# EAGLE design breakout (EAGLE 6.5.0)
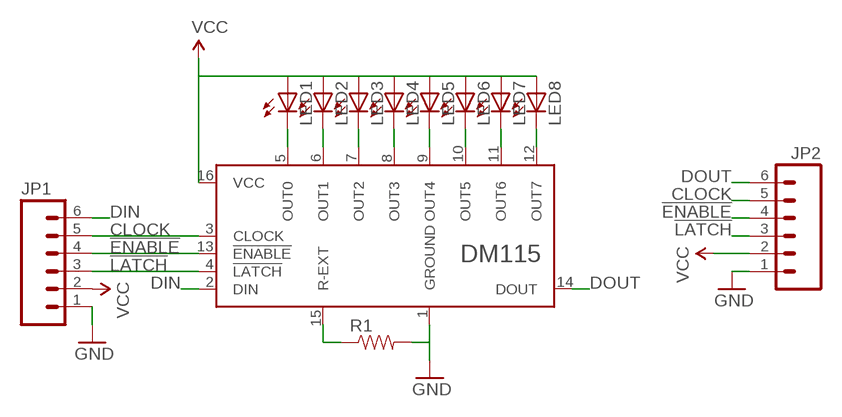
[diagram p0: schematic, sheet 1]

## Parts
JP1  M06SIP  [1X06]
JP2  M06SIP  [1X06]
LED1  LEDOVAL  [LED-OVAL]
LED2  LEDOVAL  [LED-OVAL]
LED3  LEDOVAL  [LED-OVAL]
LED4  LEDOVAL  [LED-OVAL]
LED5  LEDOVAL  [LED-OVAL]
LED6  LEDOVAL  [LED-OVAL]
LED7  LEDOVAL  [LED-OVAL]
LED8  LEDOVAL  [LED-OVAL]
R1  RESISTORAXIAL-0.3  [AXIAL-0.3]
U$1  DM115DIP16  [DIL16]

## Nets
!ENABLE: JP1.4 JP2.4 U$1.13(!ENABLE)
!LATCH: JP1.3 JP2.3 U$1.4(!LATCH)
CLOCK: JP1.5 JP2.5 U$1.3(CLOCK)
DIN: JP1.6 U$1.2(DIN)
DOUT: JP2.6 U$1.14(DOUT)
GND: JP1.1 JP2.1 R1.P$2 U$1.1(GROUND)
N$1: R1.P$1 U$1.15(R-EXT)
N$2: LED1.CATHODE(C) U$1.5(OUT0)
N$3: LED2.CATHODE(C) U$1.6(OUT1)
N$4: LED3.CATHODE(C) U$1.7(OUT2)
N$5: LED4.CATHODE(C) U$1.8(OUT3)
N$6: LED5.CATHODE(C) U$1.9(OUT4)
N$7: LED6.CATHODE(C) U$1.10(OUT5)
N$8: LED7.CATHODE(C) U$1.11(OUT6)
N$9: LED8.CATHODE(C) U$1.12(OUT7)
VCC: JP1.2 JP2.2 LED1.ANODE(A) LED2.ANODE(A) LED3.ANODE(A) LED4.ANODE(A) LED5.ANODE(A) LED6.ANODE(A) LED7.ANODE(A) LED8.ANODE(A) U$1.16(VCC)

## Library data of the parts
JP1 JP2 = dm115:M06: Header 6 Standard 6-pin 0.1" header. Use with straight break away headers (SKU : PRT-00116), right angle break away headers (PRT-00553), swiss pins (PRT-00743), machine pins (PRT-00117), and female headers (PRT-00115). Molex polarized connector foot print use with SKU : PRT-08094 with associated crimp pins and housings. NOTES ON THE VARIANTS LOCK and LOCK_LONGPADS... This footprint was designed to help hold the alignment of a through-hole component (i.e. 6-pin header) while soldering it into place. You may notice that each hole has been shifted either up or down by 0.005 of an inch from it's more standard position (which is a perfectly straight line). This slight alteration caused the pins (the squares in the middle) to touch the edges of the holes. Because they are alternating, it causes a "brace" to hold the component in place. 0.005 has proven to be the perfect amount of "off-center" position when using our standard breakaway headers. Although looks a little odd when you look at the bare footprint, once you have a header in there, the alteration is very hard to notice. Also,if you push a header all the way into place, it is covered up entirely on the bottom side. This idea of altering the position of holes to aid alignment will be further integrated into the Sparkfun Library for other footprints. It can help hold any component with 3 or more connection pins.
LED1-LED8 = dm115:LED: LEDs Standard schematic elements and footprints for 5mm, 3mm, 1206, and 0603 sized LEDs. 5mm - Spark Fun Electronics SKU : COM-00529 (and others)
R1 = dm115:RESISTOR: Resistor Basic schematic elements and footprints for 0603, 1206, and PTH resistors.
U$1 = dm115:DM115

## Board
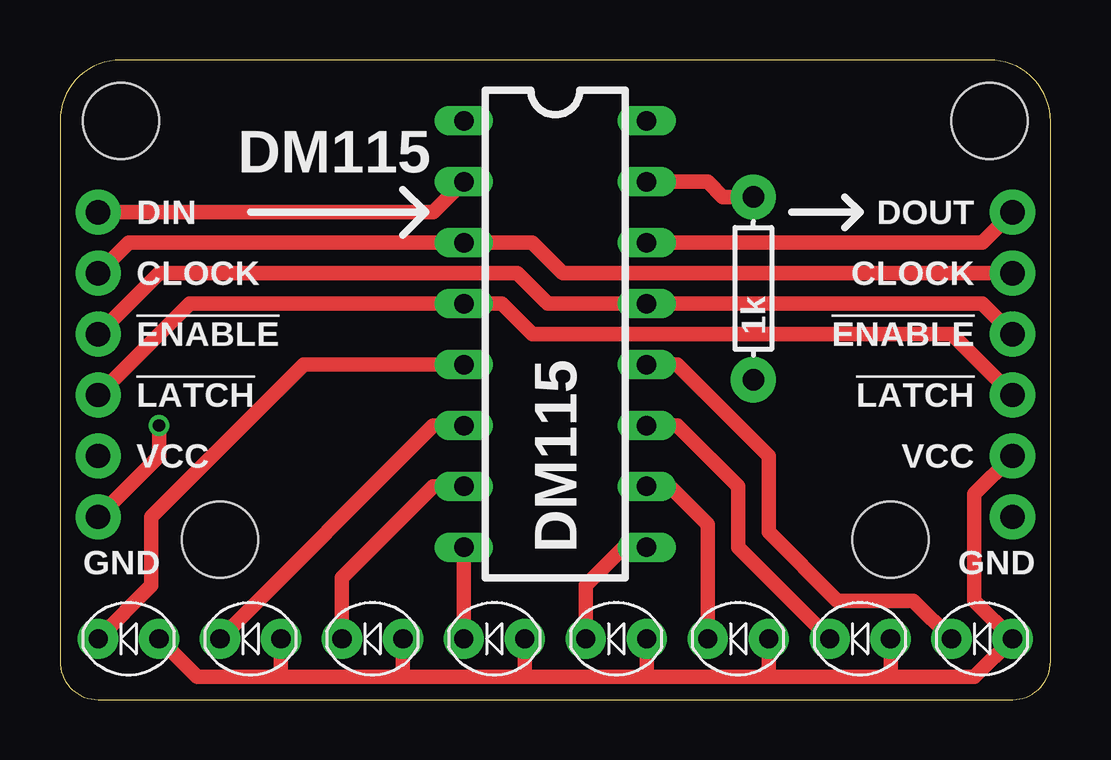
[diagram p1: board, top side]
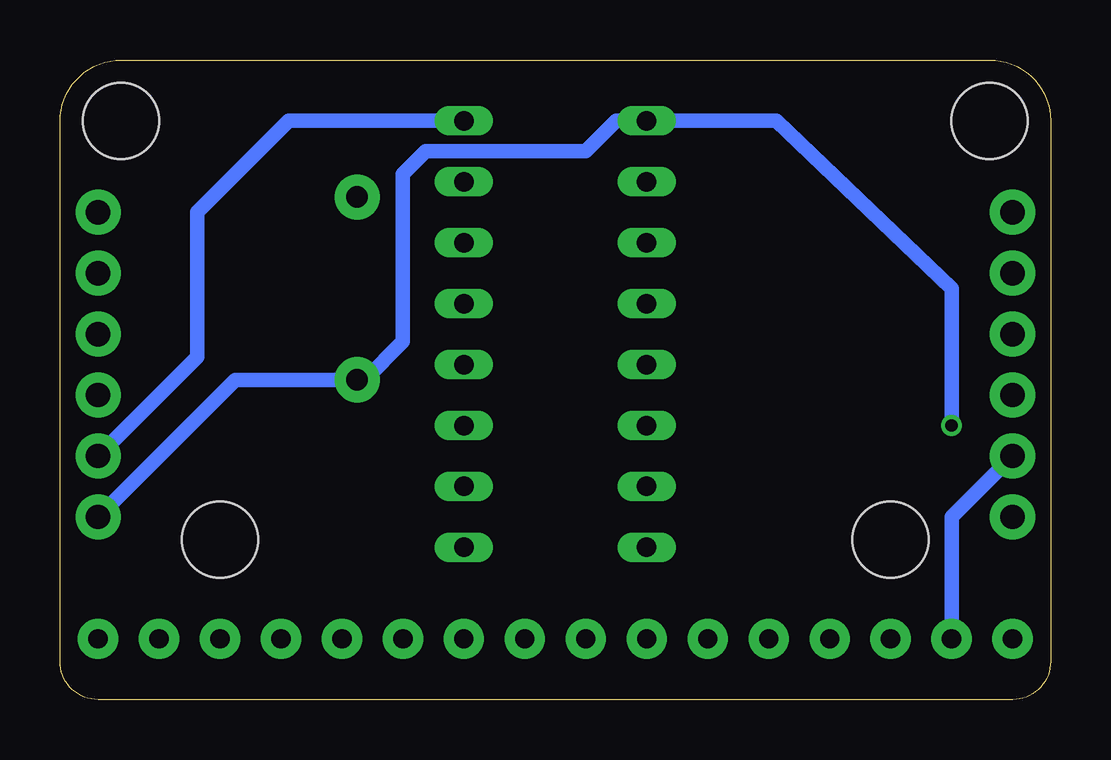
[diagram p2: board, bottom side, seen from below]

Size 41.27 x 26.67 mm. Coordinates in mm from the lower left corner, seen from the top.
Outline: 41.27,1.59 41.27,24.11 arc90 38.72,26.67 2.54,26.67 arc90 0,24.13 0,1.59 arc90 1.59,0 39.69,0 arc90 41.27,1.59
Copper layers (1*16): Top 0.0356mm / dielectric 1.5011mm / Bottom 0.0356mm
Design rules "LaenPCBOrder": minimum track width 6mil, minimum drill 13mil, track to track 6mil, track to pad 6mil, pad to pad 6mil, via to via 6mil, smd to smd 6mil, copper to edge 15mil, drill to drill 6mil, minimum pad ring 7mil, minimum via ring 7mil, stop-mask expansion 3mil, vias tented up to drill 0mil, thermal gap 10mil
Holes 3.17 mm at 2.54,24.13 38.73,24.13 6.67,6.67 34.61,6.67

### Footprints (pad centres in the part's own frame; a part is rotated, then mirrored left to right if it is on the bottom)
1X06 = drill 1.016 pad 1.88: 1 0,0; 2 2.54,0; 3 5.08,0; 4 7.62,0; 5 10.16,0; 6 12.7,0
LED-OVAL = drill 0.8 pad 1.676: ANODE 1.27,0; CATHODE -1.27,0
AXIAL-0.3 = drill 0.9 pad 1.88: P$1 -3.81,0; P$2 3.81,0
DIL16 = drill 0.813 long: 1 -8.89,-3.81; 2 -6.35,-3.81; 3 -3.81,-3.81; 4 -1.27,-3.81; 5 1.27,-3.81; 6 3.81,-3.81; 7 6.35,-3.81; 8 8.89,-3.81; 9 8.89,3.81; 10 6.35,3.81; 11 3.81,3.81; 12 1.27,3.81; 13 -1.27,3.81; 14 -3.81,3.81; 15 -6.35,3.81; 16 -8.89,3.81

### Placement (x,y rotation side)
JP1  1.59,7.62 90 top
JP2  39.69,7.62 90 top
LED1  2.86,2.54 0 top
LED2  7.94,2.54 0 top
LED3  13.02,2.54 0 top
LED4  18.1,2.54 0 top
LED5  23.18,2.54 0 top
LED6  28.26,2.54 0 top
LED7  33.34,2.54 0 top
LED8  38.42,2.54 0 top
R1  28.89,17.14 270 top
U$1  20.64,15.24 270 top

### Tracks (layer width: path | path; a pad name or v marks a point on that pad's centre or on a via)
!ENABLE
  Top 0.61: JP1.4 4.13,17.78 19.05,17.78 20.32,16.51 U$1.13 38.42,16.51 JP2.4
!LATCH
  Top 0.61: JP1.3 5.4,16.51 U$1.4 18.41,16.51 19.68,15.24 37.15,15.24 JP2.3
CLOCK
  Top 0.61: JP1.5 2.86,19.05 U$1.3 19.68,19.05 20.95,17.78 JP2.5
DIN
  Top 0.61: JP1.6 15.56,20.32 U$1.2
DOUT
  Top 0.61: U$1.14 38.42,19.05 JP2.6
GND  (via drill 0.51)
  Top 0.61: v4.13,11.43 4.13,10.16 JP1.1
  Bottom 0.61: v4.13,11.43 4.13,17.14 11.43,24.13 U$1.1 18.1,24.13 19.37,22.86 26.04,22.86 26.99,21.91 26.99,14.92 28.57,13.34 R1.P$2 33.97,13.34 JP2.1
N$1
  Top 0.61: U$1.15 26.99,21.59 27.62,20.95 R1.P$1
N$2
  Top 0.61: U$1.5 10.16,13.97 3.81,7.62 3.81,4.76 LED1.CATHODE
N$3
  Top 0.61: U$1.6 15.56,11.43 LED2.CATHODE
N$4
  Top 0.61: U$1.7 15.56,8.89 11.75,5.08 LED3.CATHODE
N$5
  Top 0.61: U$1.8 LED4.CATHODE
N$6
  Top 0.61: U$1.9 23.5,6.35 21.91,4.76 LED5.CATHODE
N$7
  Top 0.61: U$1.10 25.4,8.89 26.99,7.3 LED6.CATHODE
N$8
  Top 0.61: U$1.11 25.72,11.43 28.26,8.89 28.26,6.35 LED7.CATHODE
N$9
  Top 0.61: U$1.12 25.72,13.97 29.53,10.16 29.53,6.99 32.38,4.13 35.56,4.13 LED8.CATHODE
VCC
  Top 0.61: LED1.ANODE 5.71,0.95 9.21,0.95 | 9.21,0.95 14.29,0.95 | 14.29,0.95 19.37,0.95 | 19.37,0.95 24.45,0.95 | 24.45,0.95 29.21,0.95 | 29.21,0.95 34.61,0.95 | 34.61,0.95 38.1,0.95 LED8.ANODE 38.1,4.13 38.1,8.57 JP2.2 | LED2.ANODE 9.21,0.95 | LED3.ANODE 14.29,0.95 | LED4.ANODE 19.37,0.95 | LED5.ANODE 24.45,0.95 | LED6.ANODE 29.53,1.27 29.21,0.95 | LED7.ANODE 34.61,0.95
  Bottom 0.61: LED1.ANODE 4.13,7.62 JP1.2 | U$1.16 31.75,24.13 35.56,20.32 35.56,14.29 JP2.2

### Text on the board
tPlace: DM115 | DIN | DOUT | CLOCK | CLOCK | 1k | !ENABLE | !ENABLE | !LATCH | !LATCH | VCC | DM115 | VCC | GND | GND